# EAGLE design ProbeBoard (EAGLE 9.2.1)

## Sheet 1 of 3: ADC Schematic
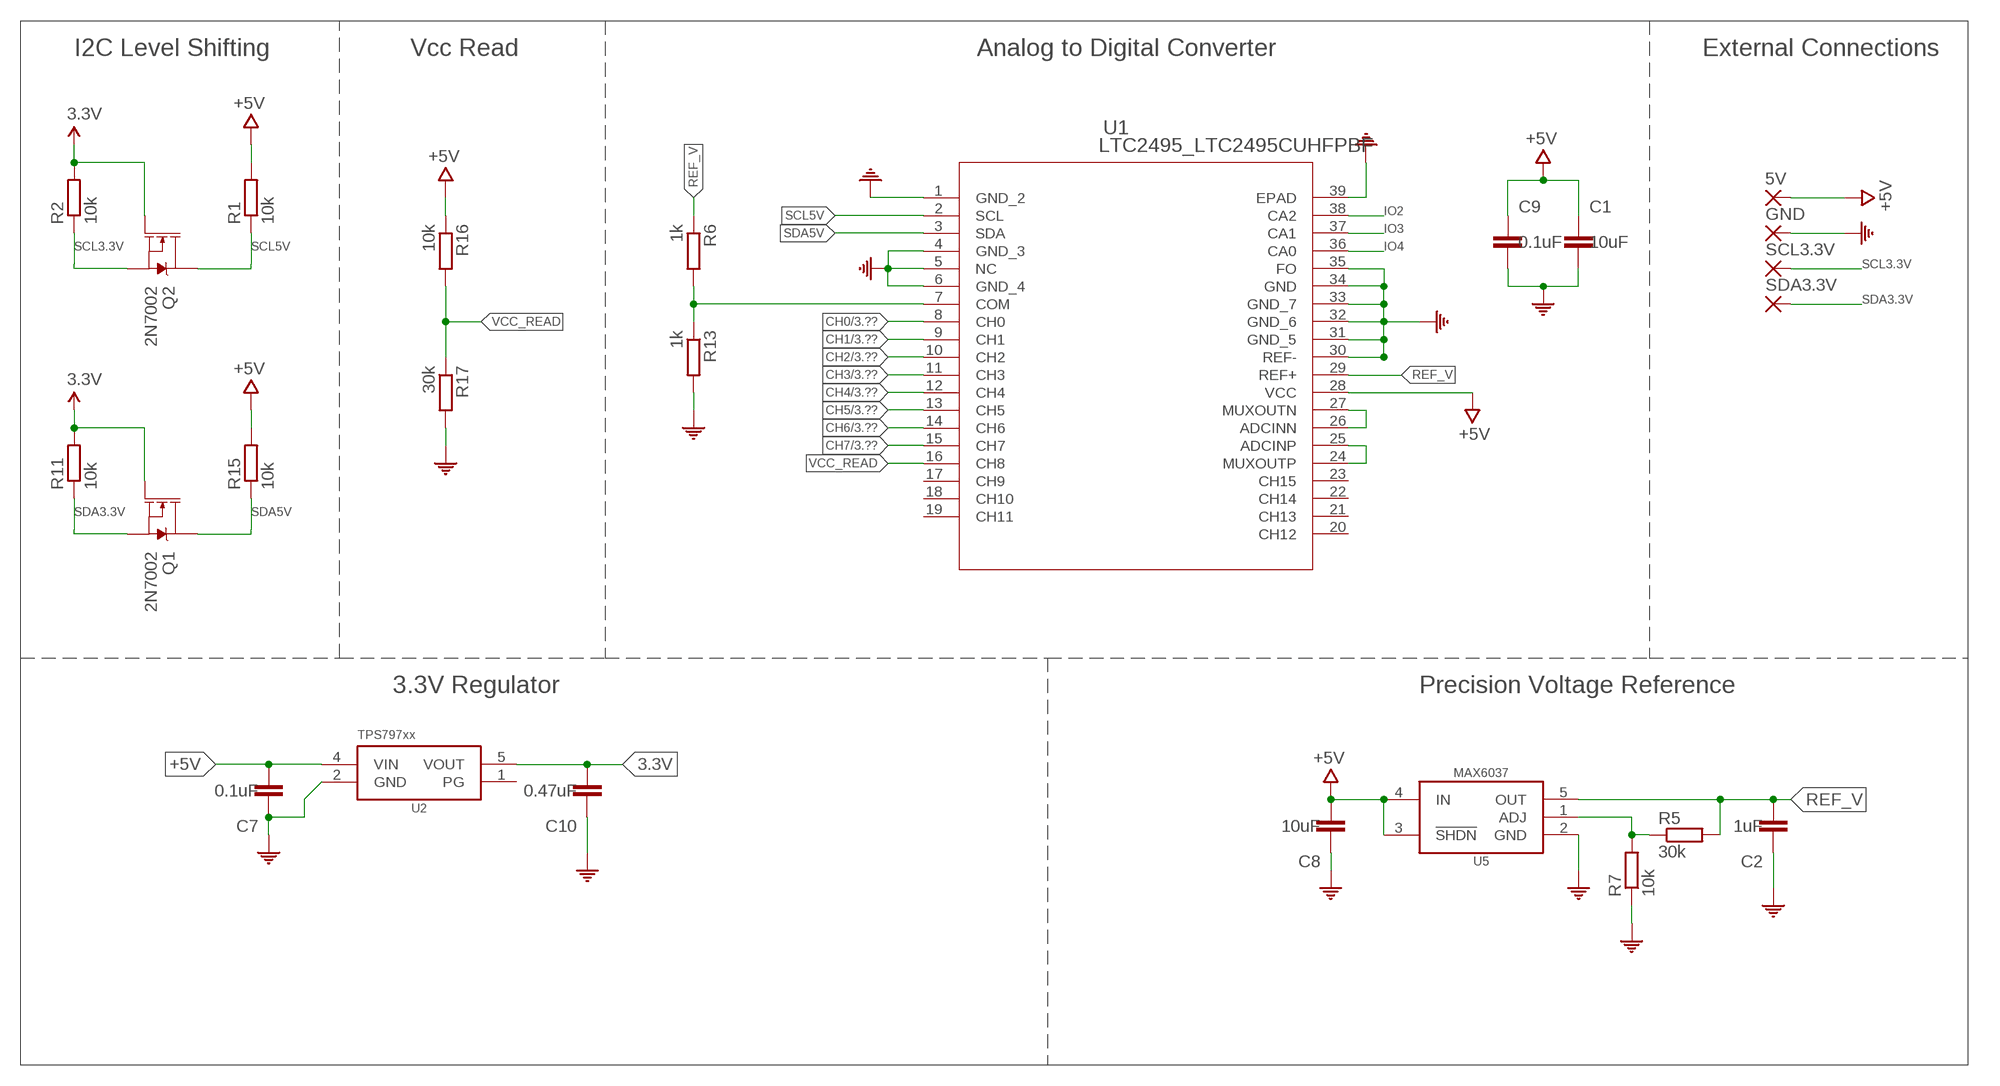
[diagram p0: schematic, sheet 1]

### Parts
5V  1,6/0,9  [1,6/0,9]
C1  10uF  C-EU10UFC0603  [C0603]
C2  1uF  C-EU1UFC0603  [C0603]
C7  0.1uF  C-EU0.1UFC0603  [C0603]
C8  10uF  C-EU10UFC0603  [C0603]
C9  0.1uF  C-EU0.1UFC0603  [C0603]
C10  0.47uF  C-EU0.47UFC0603  [C0603]
GND  1,6/0,9  [1,6/0,9]
Q1  2N7002  MOSFET-NCH-2N7002PW  [SOT323]
Q2  2N7002  MOSFET-NCH-2N7002PW  [SOT323]
R1  10k  R-EU_10KR0603  [R0603]
R2  10k  R-EU_10KR0603  [R0603]
R5  30k  R-EU_P30KR0603  [R0603]
R6  1k  R-EU_P1KR0603  [R0603]
R7  10k  R-EU_P10KR0603  [R0603]
R11  10k  R-EU_10KR0603  [R0603]
R13  1k  R-EU_P1KR0603  [R0603]
R15  10k  R-EU_10KR0603  [R0603]
R16  10k  R-EU_P10KR0603  [R0603]
R17  30k  R-EU_P30KR0603  [R0603]
SCL3.3V  1,6/0,9  [1,6/0,9]
SDA3.3V  1,6/0,9  [1,6/0,9]
U1  LTC2495_LTC2495CUHFPBF  [LTC2495_QFN-38_UHF]
U2  TPS79733  [DCK_R-PDSO-G5]
U5  MAX6037ADJSOT23  [SOT23-5]

### Nets
3.3V: C10.2 Q1.1(G) Q2.1(G) R2.2 R11.2 U2.5(VOUT)
+5V: 5V.1(P) C1.1 C7.2 C8.2 C9.1 R1.2 R15.2 R16.1 U1.28(VCC) U2.4(VIN) U5.3(!SHDN) U5.4(IN) ; also sheet 2,3
CH0: U1.8(CH0) ; also sheet 3
CH1: U1.9(CH1) ; also sheet 3
CH2: U1.10(CH2) ; also sheet 3
CH3: U1.11(CH3) ; also sheet 3
CH4: U1.12(CH4) ; also sheet 3
CH5: U1.13(CH5) ; also sheet 3
CH6: U1.14(CH6) ; also sheet 3
CH7: U1.15(CH7) ; also sheet 3
COM: C1.2 C2.1 C7.1 C8.1 C9.2 C10.1 GND.1(P) R7.1 R13.2 R17.2 U1.1(GND_2) U1.4(GND_3) U1.5(NC) U1.6(GND_4) U1.30(REF-) U1.31(GND_5) U1.32(GND_6) U1.33(GND_7) U1.34(GND) U1.35(FO) U1.39(EPAD) U2.2(GND) U5.2(GND) ; also sheet 2,3
IO2: U1.38(CA2) ; also sheet 2
IO3: U1.37(CA1) ; also sheet 2
IO4: U1.36(CA0) ; also sheet 2
N$2: U1.26(ADCINN) U1.27(MUXOUTN)
N$3: U1.24(MUXOUTP) U1.25(ADCINP)
N$4: R5.1 R7.2 U5.1(ADJ)
N$5: R6.2 R13.1 U1.7(COM)
REF_V: C2.2 R5.2 R6.1 U1.29(REF+) U5.5(OUT)
SCL3.3V: Q2.2(S) R2.1 SCL3.3V.1(P)
SCL5V: Q2.3(D) R1.1 U1.2(SCL) ; also sheet 2
SDA3.3V: Q1.2(S) R11.1 SDA3.3V.1(P)
SDA5V: Q1.3(D) R15.1 U1.3(SDA) ; also sheet 2
VCC_READ: R16.2 R17.1 U1.16(CH8)
Unconnected: U1.17(CH9) U1.18(CH10) U1.19(CH11) U1.20(CH12) U1.21(CH13) U1.22(CH14) U1.23(CH15) U2.1(PG)

### Notes on the sheet
- I2C Level Shifting | Vcc Read | Analog to Digital Converter | External Connections
- 3.3V Regulator | Precision Voltage Reference

## Sheet 2 of 3: Arduino Schematic
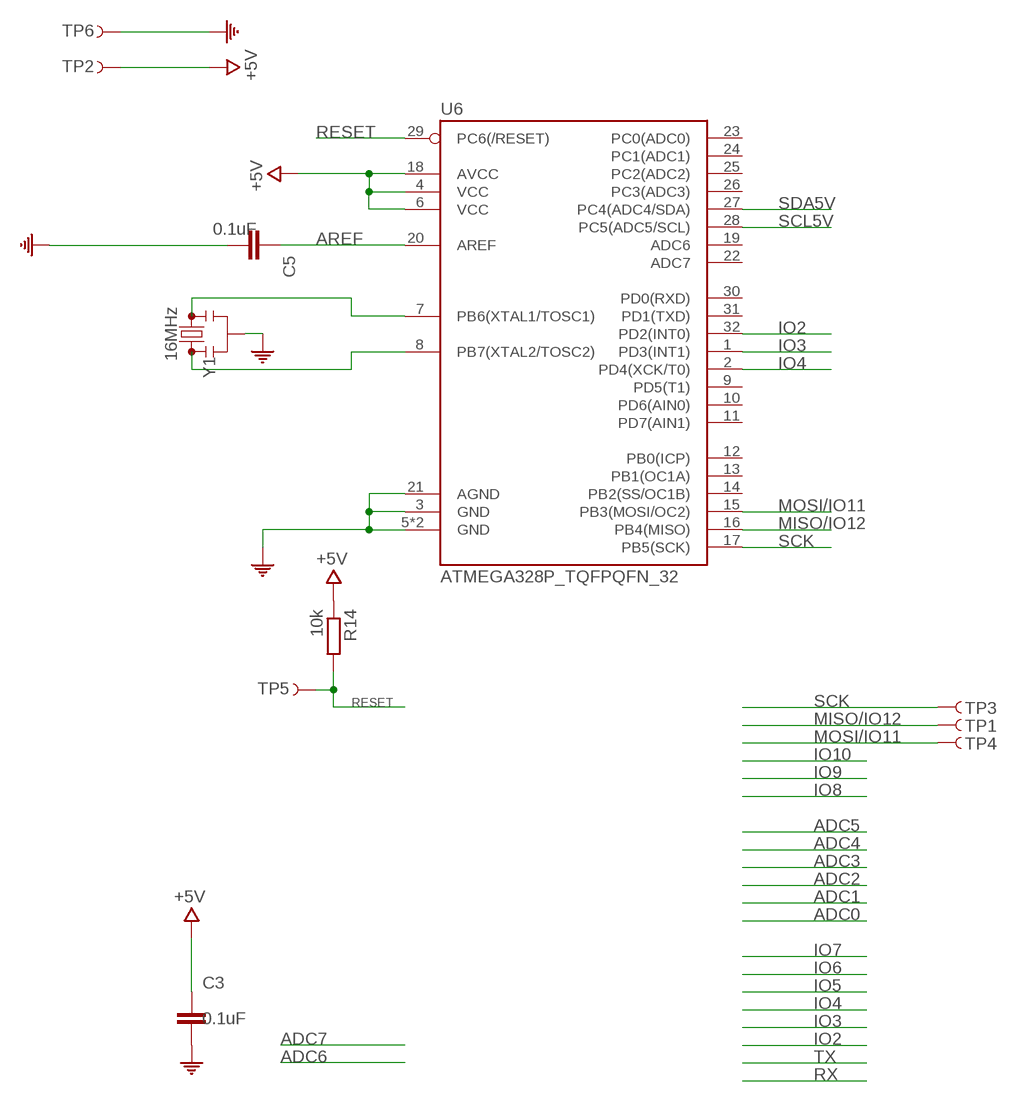
[diagram p1: schematic, sheet 2]

### Parts
C3  0.1uF  C-EU0.1UFC0603  [C0603]
C5  0.1uF  C-EU0.1UFC0603  [C0603]
R14  10k  R-EU_10KR0603  [R0603]
TP1  TEST-POINT3  [PAD.03X.03]
TP2  TEST-POINT3  [PAD.03X.03]
TP3  TEST-POINT3  [PAD.03X.03]
TP4  TEST-POINT3  [PAD.03X.03]
TP5  TEST-POINT3  [PAD.03X.03]
TP6  TEST-POINT3  [PAD.03X.03]
U6  ATMEGA328P_TQFPQFN_32  [QFN32]
Y1  16MHz  RESONATOR16MHZSMD_3.2X1.3  [RESONATOR-SMD-3.2X1.3]

### Nets
+5V: C3.1 R14.1 TP2.P$1 U6.4(VCC) U6.6(VCC) U6.18(AVCC) ; also sheet 1,3
AREF: C5.1 U6.20(AREF)
COM: C3.2 C5.2 TP6.P$1 U6.3(GND) U6.5(GND) U6.21(AGND) U6.EP(GND) Y1.2 ; also sheet 1,3
IO2: U6.32(PD2(INT0)) ; also sheet 1
IO3: U6.1(PD3(INT1)) ; also sheet 1
IO4: U6.2(PD4(XCK/T0)) ; also sheet 1
MISO/IO12: TP1.P$1 U6.16(PB4(MISO))
MOSI/IO11: TP4.P$1 U6.15(PB3(MOSI/OC2))
N$1: U6.7(PB6(XTAL1/TOSC1)) Y1.3
N$7: U6.8(PB7(XTAL2/TOSC2)) Y1.1
RESET: R14.2 TP5.P$1 U6.29(PC6(/RESET))
SCK: TP3.P$1 U6.17(PB5(SCK))
SCL5V: U6.28(PC5(ADC5/SCL)) ; also sheet 1
SDA5V: U6.27(PC4(ADC4/SDA)) ; also sheet 1
Unconnected: U6.9(PD5(T1)) U6.10(PD6(AIN0)) U6.11(PD7(AIN1)) U6.12(PB0(ICP)) U6.13(PB1(OC1A)) U6.14(PB2(SS/OC1B)) U6.19(ADC6) U6.22(ADC7) U6.23(PC0(ADC0)) U6.24(PC1(ADC1)) U6.25(PC2(ADC2)) U6.26(PC3(ADC3)) U6.30(PD0(RXD)) U6.31(PD1(TXD))

## Sheet 3 of 3: Thermistor Connections
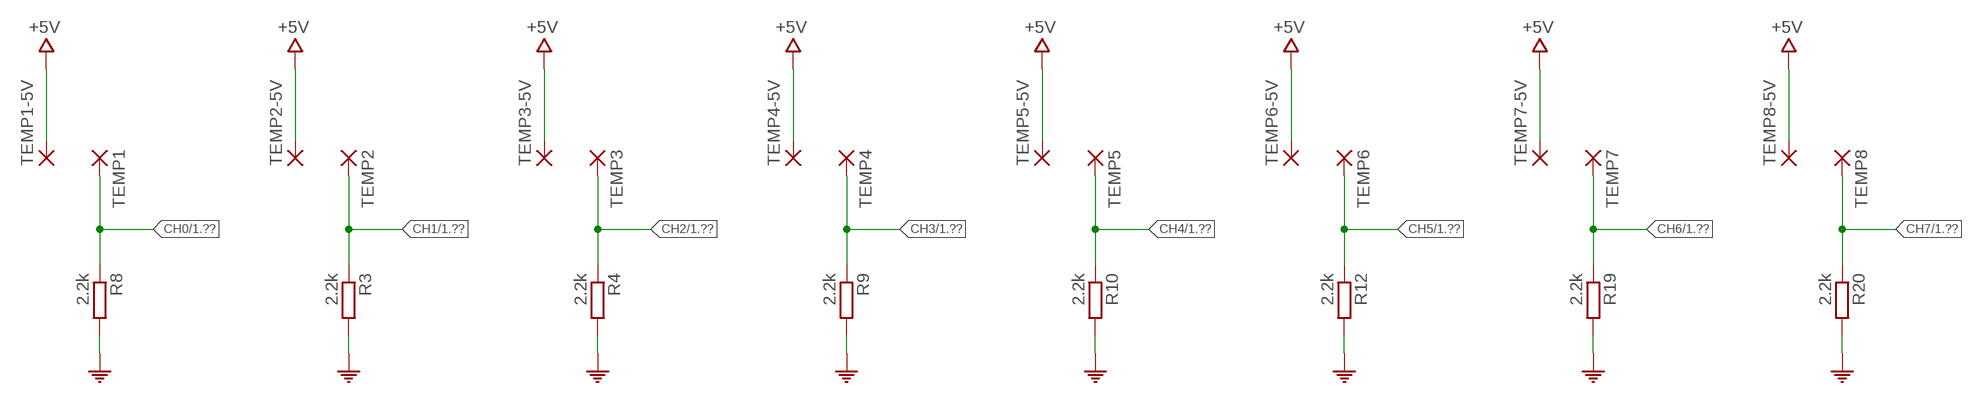
[diagram p2: schematic, sheet 3]

### Parts
R3  2.2k  R-EU_R0603  [R0603]
R4  2.2k  R-EU_R0603  [R0603]
R8  2.2k  R-EU_R0603  [R0603]
R9  2.2k  R-EU_R0603  [R0603]
R10  2.2k  R-EU_R0603  [R0603]
R12  2.2k  R-EU_R0603  [R0603]
R19  2.2k  R-EU_R0603  [R0603]
R20  2.2k  R-EU_R0603  [R0603]
TEMP1  1,6/0,9  [1,6/0,9]
TEMP1-5V  1,6/0,9  [1,6/0,9]
TEMP2  1,6/0,9  [1,6/0,9]
TEMP2-5V  1,6/0,9  [1,6/0,9]
TEMP3  1,6/0,9  [1,6/0,9]
TEMP3-5V  1,6/0,9  [1,6/0,9]
TEMP4  1,6/0,9  [1,6/0,9]
TEMP4-5V  1,6/0,9  [1,6/0,9]
TEMP5  1,6/0,9  [1,6/0,9]
TEMP5-5V  1,6/0,9  [1,6/0,9]
TEMP6  1,6/0,9  [1,6/0,9]
TEMP6-5V  1,6/0,9  [1,6/0,9]
TEMP7  1,6/0,9  [1,6/0,9]
TEMP7-5V  1,6/0,9  [1,6/0,9]
TEMP8  1,6/0,9  [1,6/0,9]
TEMP8-5V  1,6/0,9  [1,6/0,9]

### Nets
+5V: TEMP1-5V.1(P) TEMP2-5V.1(P) TEMP3-5V.1(P) TEMP4-5V.1(P) TEMP5-5V.1(P) TEMP6-5V.1(P) TEMP7-5V.1(P) TEMP8-5V.1(P) ; also sheet 1,2
CH0: R8.1 TEMP1.1(P) ; also sheet 1
CH1: R3.1 TEMP2.1(P) ; also sheet 1
CH2: R4.1 TEMP3.1(P) ; also sheet 1
CH3: R9.1 TEMP4.1(P) ; also sheet 1
CH4: R10.1 TEMP5.1(P) ; also sheet 1
CH5: R12.1 TEMP6.1(P) ; also sheet 1
CH6: R19.1 TEMP7.1(P) ; also sheet 1
CH7: R20.1 TEMP8.1(P) ; also sheet 1
COM: R3.2 R4.2 R8.2 R9.2 R10.2 R12.2 R19.2 R20.2 ; also sheet 1,2

## Library data of the parts
5V GND SCL3.3V SDA3.3V TEMP1 TEMP1-5V TEMP2 TEMP2-5V TEMP3 TEMP3-5V TEMP4 TEMP4-5V TEMP5 TEMP5-5V TEMP6 TEMP6-5V TEMP7 TEMP7-5V TEMP8 TEMP8-5V = wirepad:1,6/0,9: THROUGH-HOLE PAD
C1 C8 = bschulz_passives:C-EU: CAPACITOR, European symbol; DIGIKEY: 490-10728-1-ND; DIGIKEY_PART_NUMBER: 445-9104-6-ND; MANUFACTURER: TDK Corporation; MANUFACTURER_PART_NUMBER: C1608X7S0J106M080AC; MF: Murata; MPN: GRM188R61C106KAALD; PRICE: 0.18328
C2 = bschulz_passives:C-EU: CAPACITOR, European symbol; DIGIKEY: 490-10479-1-ND; DIGIKEY_PART_NUMBER: 1276-1184-6-ND; MANUFACTURER: Samsung Electro-Mechanics; MANUFACTURER_PART_NUMBER: CL10B105KA8NNNC; MF: Murata; MPN: GRM188R61C105KA12D; PRICE: 0.01719
C3 C5 C7 C9 = bschulz_passives:C-EU: CAPACITOR, European symbol; DIGIKEY: 490-6051-1-ND; DIGIKEY_PART_NUMBER: 478-7939-2-ND; MANUFACTURER: AVX Corporation; MANUFACTURER_PART_NUMBER: 0603ZC104KAT2A; MF: Murata; MPN: GCM188R71E104KA57D; PRICE: 0.08325
C10 = bschulz_passives:C-EU: CAPACITOR, European symbol; DIGIKEY: 1276-2083-1-ND; DIGIKEY_PART_NUMBER: 478-10367-1-ND; MANUFACTURER: AVX Corporation; MANUFACTURER_PART_NUMBER: 0603ZC474KAT2A; MF: Samsung; MPN: CL10B474KA8NNNC; PRICE: 0.02904
Q1 Q2 = bschulz:MOSFET-NCH: N-channel MOSFETs Voltage controlled devices that allow control of high current outputs. SparkFun Products: SparkFun OpenScale <https://www.sparkfun.com/products/13261> SparkFun Digital Sandbox <https://www.sparkfun.com/products/12651> SparkFun Monster Moto Shield <https://www.sparkfun.com/products/10182> SparkFun MOSFET Power Controller <https://www.sparkfun.com/products/11214>; DIGIKEY: 2N7002W-FDICT-ND; MF: Diodes Incorporated; MPN: 2N7002W-7-F; PROD_ID: TRANS-11151
R1 R2 R11 R14 R15 = bschulz_passives:R-EU_: RESISTOR, European symbol Digikey Parts: Yageo, 0402 <https://www.digikey.com/products/en/resistors/chip-resistor-surface-mount/52?k=&pkeyword=&sf=0&FV=ffec1104%2Cfffc000d%2C1c0002%2C440067%2C1f140000%2Cffe00034%2C400004&quantity=&ColumnSort=0&page=1&stock=1&pageSize=25> Yageo, 0603 <https://www.digikey.com/products/en/resistors/chip-resistor-surface-mount/52?k=&pkeyword=&s=4356&s=47360&sf=0&FV=fffc000d%2C1c0002%2C142c040c%2C1f140000%2Cffe00034&quantity=10&ColumnSort=1000011&page=1&stock=1&pageSize=25> Panasonic, 0603 <https://www.digikey.com/products/en/resistors/chip-resistor-surface-mount/52?k=&pkeyword=&pv252=68&sf=0&FV=ffec373d%2C1c0002%2C142c040c%2C1f140000%2Cffe00034%2C80002%2Cc0001&quantity=&ColumnSort=0&page=1&stock=1&pageSize=25> Panasonic, precision, 0603 <https://www.digikey.com/products/en/resistors/chip-resistor-surface-mount/52?FV=ffec4907%2Cfffc000a%2Cc0172%2C142c040c%2C1f140000%2Cffe00034%2C1c0002&quantity=100&ColumnSort=2085&page=1&stock=1&pageSize=25> Panasonic, 0805 <https://www.digikey.com/products/en/resistors/chip-resistor-surface-mount/52?k=&pkeyword=&pv3=1&sf=0&FV=ffec373d%2C1c0002%2C1f140000%2Cffe00034%2C142c040d&quantity=&ColumnSort=0&page=1&stock=1&pageSize=25> Rohm, current sense <https://www.digikey.com/products/en/resistors/chip-resistor-surface-mount/52?k=&pkeyword=&pv3=1&sf=0&FV=ffecb688%2C1f140000%2Cffe00034%2C1c0002&quantity=&ColumnSort=0&page=1&stock=1&pageSize=25> Vishay, pulse proof automotive <https://www.digikey.com/products/en/resistors/chip-resistor-surface-mount/52?k=&pkeyword=&pv7=2&sf=0&FV=ffec5d6b%2Cffe00034%2C1f140000&quantity=&ColumnSort=0&page=1&stock=1&pageSize=25>; DIGIKEY: 311-10.0KHRCT-ND; DIGIKEY_PART_NUMBER: P10KGTR-ND; MANUFACTURER: Panasonic Electronic Components; MANUFACTURER_PART_NUMBER: ERJ-3GEYJ103V; MF: Yageo; MPN: RC0603FR-0710KL; PRICE: 0.00494; VALUE_PART: 10k
R3 R4 R8-R10 R12 R19 R20 = bschulz_passives:R-EU_: RESISTOR, European symbol Digikey Parts: Yageo, 0402 <https://www.digikey.com/products/en/resistors/chip-resistor-surface-mount/52?k=&pkeyword=&sf=0&FV=ffec1104%2Cfffc000d%2C1c0002%2C440067%2C1f140000%2Cffe00034%2C400004&quantity=&ColumnSort=0&page=1&stock=1&pageSize=25> Yageo, 0603 <https://www.digikey.com/products/en/resistors/chip-resistor-surface-mount/52?k=&pkeyword=&s=4356&s=47360&sf=0&FV=fffc000d%2C1c0002%2C142c040c%2C1f140000%2Cffe00034&quantity=10&ColumnSort=1000011&page=1&stock=1&pageSize=25> Panasonic, 0603 <https://www.digikey.com/products/en/resistors/chip-resistor-surface-mount/52?k=&pkeyword=&pv252=68&sf=0&FV=ffec373d%2C1c0002%2C142c040c%2C1f140000%2Cffe00034%2C80002%2Cc0001&quantity=&ColumnSort=0&page=1&stock=1&pageSize=25> Panasonic, precision, 0603 <https://www.digikey.com/products/en/resistors/chip-resistor-surface-mount/52?FV=ffec4907%2Cfffc000a%2Cc0172%2C142c040c%2C1f140000%2Cffe00034%2C1c0002&quantity=100&ColumnSort=2085&page=1&stock=1&pageSize=25> Panasonic, 0805 <https://www.digikey.com/products/en/resistors/chip-resistor-surface-mount/52?k=&pkeyword=&pv3=1&sf=0&FV=ffec373d%2C1c0002%2C1f140000%2Cffe00034%2C142c040d&quantity=&ColumnSort=0&page=1&stock=1&pageSize=25> Rohm, current sense <https://www.digikey.com/products/en/resistors/chip-resistor-surface-mount/52?k=&pkeyword=&pv3=1&sf=0&FV=ffecb688%2C1f140000%2Cffe00034%2C1c0002&quantity=&ColumnSort=0&page=1&stock=1&pageSize=25> Vishay, pulse proof automotive <https://www.digikey.com/products/en/resistors/chip-resistor-surface-mount/52?k=&pkeyword=&pv7=2&sf=0&FV=ffec5d6b%2Cffe00034%2C1f140000&quantity=&ColumnSort=0&page=1&stock=1&pageSize=25>; DIGIKEY_PART_NUMBER: P2.2KDBTR-ND; MANUFACTURER: Panasonic Electronic Components; MANUFACTURER_PART_NUMBER: ERA-3AEB222V; MF: Yageo; PRICE: 0.03717
R5 = bschulz_passives:R-EU_: RESISTOR, European symbol Digikey Parts: Yageo, 0402 <https://www.digikey.com/products/en/resistors/chip-resistor-surface-mount/52?k=&pkeyword=&sf=0&FV=ffec1104%2Cfffc000d%2C1c0002%2C440067%2C1f140000%2Cffe00034%2C400004&quantity=&ColumnSort=0&page=1&stock=1&pageSize=25> Yageo, 0603 <https://www.digikey.com/products/en/resistors/chip-resistor-surface-mount/52?k=&pkeyword=&s=4356&s=47360&sf=0&FV=fffc000d%2C1c0002%2C142c040c%2C1f140000%2Cffe00034&quantity=10&ColumnSort=1000011&page=1&stock=1&pageSize=25> Panasonic, 0603 <https://www.digikey.com/products/en/resistors/chip-resistor-surface-mount/52?k=&pkeyword=&pv252=68&sf=0&FV=ffec373d%2C1c0002%2C142c040c%2C1f140000%2Cffe00034%2C80002%2Cc0001&quantity=&ColumnSort=0&page=1&stock=1&pageSize=25> Panasonic, precision, 0603 <https://www.digikey.com/products/en/resistors/chip-resistor-surface-mount/52?FV=ffec4907%2Cfffc000a%2Cc0172%2C142c040c%2C1f140000%2Cffe00034%2C1c0002&quantity=100&ColumnSort=2085&page=1&stock=1&pageSize=25> Panasonic, 0805 <https://www.digikey.com/products/en/resistors/chip-resistor-surface-mount/52?k=&pkeyword=&pv3=1&sf=0&FV=ffec373d%2C1c0002%2C1f140000%2Cffe00034%2C142c040d&quantity=&ColumnSort=0&page=1&stock=1&pageSize=25> Rohm, current sense <https://www.digikey.com/products/en/resistors/chip-resistor-surface-mount/52?k=&pkeyword=&pv3=1&sf=0&FV=ffecb688%2C1f140000%2Cffe00034%2C1c0002&quantity=&ColumnSort=0&page=1&stock=1&pageSize=25> Vishay, pulse proof automotive <https://www.digikey.com/products/en/resistors/chip-resistor-surface-mount/52?k=&pkeyword=&pv7=2&sf=0&FV=ffec5d6b%2Cffe00034%2C1f140000&quantity=&ColumnSort=0&page=1&stock=1&pageSize=25>; DIGIKEY: P30KDBCT-ND; DIGIKEY_PART_NUMBER: P30KGDKR-ND; MANUFACTURER: Panasonic Electronic Components; MANUFACTURER_PART_NUMBER: ERJ-3GEYJ303V; MF: Panasonic; MPN: ERA-3AEB303V; PRICE: 0.00758; VALUE_PART: 30k
R6 R13 = bschulz_passives:R-EU_: RESISTOR, European symbol Digikey Parts: Yageo, 0402 <https://www.digikey.com/products/en/resistors/chip-resistor-surface-mount/52?k=&pkeyword=&sf=0&FV=ffec1104%2Cfffc000d%2C1c0002%2C440067%2C1f140000%2Cffe00034%2C400004&quantity=&ColumnSort=0&page=1&stock=1&pageSize=25> Yageo, 0603 <https://www.digikey.com/products/en/resistors/chip-resistor-surface-mount/52?k=&pkeyword=&s=4356&s=47360&sf=0&FV=fffc000d%2C1c0002%2C142c040c%2C1f140000%2Cffe00034&quantity=10&ColumnSort=1000011&page=1&stock=1&pageSize=25> Panasonic, 0603 <https://www.digikey.com/products/en/resistors/chip-resistor-surface-mount/52?k=&pkeyword=&pv252=68&sf=0&FV=ffec373d%2C1c0002%2C142c040c%2C1f140000%2Cffe00034%2C80002%2Cc0001&quantity=&ColumnSort=0&page=1&stock=1&pageSize=25> Panasonic, precision, 0603 <https://www.digikey.com/products/en/resistors/chip-resistor-surface-mount/52?FV=ffec4907%2Cfffc000a%2Cc0172%2C142c040c%2C1f140000%2Cffe00034%2C1c0002&quantity=100&ColumnSort=2085&page=1&stock=1&pageSize=25> Panasonic, 0805 <https://www.digikey.com/products/en/resistors/chip-resistor-surface-mount/52?k=&pkeyword=&pv3=1&sf=0&FV=ffec373d%2C1c0002%2C1f140000%2Cffe00034%2C142c040d&quantity=&ColumnSort=0&page=1&stock=1&pageSize=25> Rohm, current sense <https://www.digikey.com/products/en/resistors/chip-resistor-surface-mount/52?k=&pkeyword=&pv3=1&sf=0&FV=ffecb688%2C1f140000%2Cffe00034%2C1c0002&quantity=&ColumnSort=0&page=1&stock=1&pageSize=25> Vishay, pulse proof automotive <https://www.digikey.com/products/en/resistors/chip-resistor-surface-mount/52?k=&pkeyword=&pv7=2&sf=0&FV=ffec5d6b%2Cffe00034%2C1f140000&quantity=&ColumnSort=0&page=1&stock=1&pageSize=25>; DIGIKEY: P1.0KDBCT-ND; DIGIKEY_PART_NUMBER: P1.0KDBDKR-ND; MANUFACTURER: Panasonic Electronic Components; MANUFACTURER_PART_NUMBER: ERA-3AEB102V; MF: Panasonic; MPN: ERA-3AEB102V; PRICE: 0.04906; VALUE_PART: 1k
R7 = bschulz_passives:R-EU_: RESISTOR, European symbol Digikey Parts: Yageo, 0402 <https://www.digikey.com/products/en/resistors/chip-resistor-surface-mount/52?k=&pkeyword=&sf=0&FV=ffec1104%2Cfffc000d%2C1c0002%2C440067%2C1f140000%2Cffe00034%2C400004&quantity=&ColumnSort=0&page=1&stock=1&pageSize=25> Yageo, 0603 <https://www.digikey.com/products/en/resistors/chip-resistor-surface-mount/52?k=&pkeyword=&s=4356&s=47360&sf=0&FV=fffc000d%2C1c0002%2C142c040c%2C1f140000%2Cffe00034&quantity=10&ColumnSort=1000011&page=1&stock=1&pageSize=25> Panasonic, 0603 <https://www.digikey.com/products/en/resistors/chip-resistor-surface-mount/52?k=&pkeyword=&pv252=68&sf=0&FV=ffec373d%2C1c0002%2C142c040c%2C1f140000%2Cffe00034%2C80002%2Cc0001&quantity=&ColumnSort=0&page=1&stock=1&pageSize=25> Panasonic, precision, 0603 <https://www.digikey.com/products/en/resistors/chip-resistor-surface-mount/52?FV=ffec4907%2Cfffc000a%2Cc0172%2C142c040c%2C1f140000%2Cffe00034%2C1c0002&quantity=100&ColumnSort=2085&page=1&stock=1&pageSize=25> Panasonic, 0805 <https://www.digikey.com/products/en/resistors/chip-resistor-surface-mount/52?k=&pkeyword=&pv3=1&sf=0&FV=ffec373d%2C1c0002%2C1f140000%2Cffe00034%2C142c040d&quantity=&ColumnSort=0&page=1&stock=1&pageSize=25> Rohm, current sense <https://www.digikey.com/products/en/resistors/chip-resistor-surface-mount/52?k=&pkeyword=&pv3=1&sf=0&FV=ffecb688%2C1f140000%2Cffe00034%2C1c0002&quantity=&ColumnSort=0&page=1&stock=1&pageSize=25> Vishay, pulse proof automotive <https://www.digikey.com/products/en/resistors/chip-resistor-surface-mount/52?k=&pkeyword=&pv7=2&sf=0&FV=ffec5d6b%2Cffe00034%2C1f140000&quantity=&ColumnSort=0&page=1&stock=1&pageSize=25>; DIGIKEY: P10KDBCT-ND; DIGIKEY_PART_NUMBER: P10KGTR-ND; MANUFACTURER: Panasonic Electronic Components; MANUFACTURER_PART_NUMBER: ERJ-3GEYJ103V; MF: Panasonic; MPN: ERA-3AEB103V; PRICE: 0.00494; VALUE_PART: 10k
R16 = bschulz_passives:R-EU_: RESISTOR, European symbol Digikey Parts: Yageo, 0402 <https://www.digikey.com/products/en/resistors/chip-resistor-surface-mount/52?k=&pkeyword=&sf=0&FV=ffec1104%2Cfffc000d%2C1c0002%2C440067%2C1f140000%2Cffe00034%2C400004&quantity=&ColumnSort=0&page=1&stock=1&pageSize=25> Yageo, 0603 <https://www.digikey.com/products/en/resistors/chip-resistor-surface-mount/52?k=&pkeyword=&s=4356&s=47360&sf=0&FV=fffc000d%2C1c0002%2C142c040c%2C1f140000%2Cffe00034&quantity=10&ColumnSort=1000011&page=1&stock=1&pageSize=25> Panasonic, 0603 <https://www.digikey.com/products/en/resistors/chip-resistor-surface-mount/52?k=&pkeyword=&pv252=68&sf=0&FV=ffec373d%2C1c0002%2C142c040c%2C1f140000%2Cffe00034%2C80002%2Cc0001&quantity=&ColumnSort=0&page=1&stock=1&pageSize=25> Panasonic, precision, 0603 <https://www.digikey.com/products/en/resistors/chip-resistor-surface-mount/52?FV=ffec4907%2Cfffc000a%2Cc0172%2C142c040c%2C1f140000%2Cffe00034%2C1c0002&quantity=100&ColumnSort=2085&page=1&stock=1&pageSize=25> Panasonic, 0805 <https://www.digikey.com/products/en/resistors/chip-resistor-surface-mount/52?k=&pkeyword=&pv3=1&sf=0&FV=ffec373d%2C1c0002%2C1f140000%2Cffe00034%2C142c040d&quantity=&ColumnSort=0&page=1&stock=1&pageSize=25> Rohm, current sense <https://www.digikey.com/products/en/resistors/chip-resistor-surface-mount/52?k=&pkeyword=&pv3=1&sf=0&FV=ffecb688%2C1f140000%2Cffe00034%2C1c0002&quantity=&ColumnSort=0&page=1&stock=1&pageSize=25> Vishay, pulse proof automotive <https://www.digikey.com/products/en/resistors/chip-resistor-surface-mount/52?k=&pkeyword=&pv7=2&sf=0&FV=ffec5d6b%2Cffe00034%2C1f140000&quantity=&ColumnSort=0&page=1&stock=1&pageSize=25>; DIGIKEY: P10KDBCT-ND; DIGIKEY_PART_NUMBER: P1.0KDBDKR-ND; MANUFACTURER: Panasonic Electronic Components; MANUFACTURER_PART_NUMBER: ERA-3AEB102V; MF: Panasonic; MPN: ERA-3AEB103V; PRICE: 0.04906; VALUE_PART: 10k
R17 = bschulz_passives:R-EU_: RESISTOR, European symbol Digikey Parts: Yageo, 0402 <https://www.digikey.com/products/en/resistors/chip-resistor-surface-mount/52?k=&pkeyword=&sf=0&FV=ffec1104%2Cfffc000d%2C1c0002%2C440067%2C1f140000%2Cffe00034%2C400004&quantity=&ColumnSort=0&page=1&stock=1&pageSize=25> Yageo, 0603 <https://www.digikey.com/products/en/resistors/chip-resistor-surface-mount/52?k=&pkeyword=&s=4356&s=47360&sf=0&FV=fffc000d%2C1c0002%2C142c040c%2C1f140000%2Cffe00034&quantity=10&ColumnSort=1000011&page=1&stock=1&pageSize=25> Panasonic, 0603 <https://www.digikey.com/products/en/resistors/chip-resistor-surface-mount/52?k=&pkeyword=&pv252=68&sf=0&FV=ffec373d%2C1c0002%2C142c040c%2C1f140000%2Cffe00034%2C80002%2Cc0001&quantity=&ColumnSort=0&page=1&stock=1&pageSize=25> Panasonic, precision, 0603 <https://www.digikey.com/products/en/resistors/chip-resistor-surface-mount/52?FV=ffec4907%2Cfffc000a%2Cc0172%2C142c040c%2C1f140000%2Cffe00034%2C1c0002&quantity=100&ColumnSort=2085&page=1&stock=1&pageSize=25> Panasonic, 0805 <https://www.digikey.com/products/en/resistors/chip-resistor-surface-mount/52?k=&pkeyword=&pv3=1&sf=0&FV=ffec373d%2C1c0002%2C1f140000%2Cffe00034%2C142c040d&quantity=&ColumnSort=0&page=1&stock=1&pageSize=25> Rohm, current sense <https://www.digikey.com/products/en/resistors/chip-resistor-surface-mount/52?k=&pkeyword=&pv3=1&sf=0&FV=ffecb688%2C1f140000%2Cffe00034%2C1c0002&quantity=&ColumnSort=0&page=1&stock=1&pageSize=25> Vishay, pulse proof automotive <https://www.digikey.com/products/en/resistors/chip-resistor-surface-mount/52?k=&pkeyword=&pv7=2&sf=0&FV=ffec5d6b%2Cffe00034%2C1f140000&quantity=&ColumnSort=0&page=1&stock=1&pageSize=25>; DIGIKEY: P30KDBCT-ND; DIGIKEY_PART_NUMBER: P2.2KDBTR-ND; MANUFACTURER: Panasonic Electronic Components; MANUFACTURER_PART_NUMBER: ERA-3AEB222V; MF: Panasonic; MPN: ERA-3AEB303V; PRICE: 0.03717; VALUE_PART: 30k
TP1-TP6 = SparkFun-Passives:TEST-POINT: Bare copper test points for troubleshooting or ICT
U1 = ProbeBoard:LTC2495_LTC2495CUHFPBF; DIGIKEY_PART_NUMBER: LTC2495IUHF#PBF-ND; MANUFACTURER: Linear Technology/Analog Devices; MANUFACTURER_PART_NUMBER: LTC2495CUHF#PBF; PRICE: 5.11040; VENDOR: Linear Technology
U2 = bschulz:TPS797*: TPS797* - Ultra Low Power Low Dropout Linear Regulator Characteristics: Vin: 1.4V ~ 5.5V Vout: 1.8, 2.85, 3.0, 3.3V fixed IQ: 1.2μA typ, 2μA max Voltage Accuracy: 4% max Dropout Voltage: 105mV @ 10mA Output Current: 50 mA Operating Temperature: -40°C to 85°C Digikey: TPS79733 (3.3V Fixed) <https://www.digikey.com/product-detail/en/texas-instruments/TPS79733DCKR/296-11990-1-ND/390520> TPS79730 (3.0V Fixed) <https://www.digikey.com/product-detail/en/texas-instruments/TPS79730DCKR/296-11989-1-ND/390518> TPS797285 (2.85V Fixed) <https://www.digikey.com/product-detail/en/texas-instruments/TPS797285DCKR/296-25465-1-ND/2187585> TPS79718 (1.8V Fixed) <https://www.digikey.com/product-detail/en/texas-instruments/TPS79718DCKR/296-11988-1-ND/390516>; DIGIKEY: 296-11990-1-ND; MF: TI; MPN: TPS79733DCKR
U5 = bschulz:MAX6037: MAX6037 - Low Power Voltage Referance with Shutdown Characteristics: Vin: 2.5V ~ 5.5V Vout: 1.184V ~ 5V IQ: 190μA Iout: 5mA Tolerance: ± 0.3% Operating Temperature: -40°C to 125°C Digikey: MAX6037BAUKADJ (Adjustable) <https://www.digikey.com/product-detail/en/maxim-integrated/MAX6037BAUKADJ-T/MAX6037BAUKADJ-TCT-ND/5821111>; DIGIKEY: MAX6037BAUKADJ+TCT-ND; MF: Maxim; MPN: MAX6037BAUKADJ+T
U6 = bschulz:ATMEGA328P_TQFP: Popular 328P in QFP Storefront component: ATmega328 - TQFP <https://www.sparkfun.com/products/13448> (COM-13448) Datasheet <http://www.sparkfun.com/datasheets/Components/SMD/ATMega328.pdf> SparkFun Products SparkFun RedBoard - Programmed with Arduino <https://www.sparkfun.com/products/12757> (DEV-12757) Arduino Pro Mini 328 - 5V/16MHz <https://www.sparkfun.com/products/11113> (DEV-11113) Arduino Pro Mini 328 - 3.3V/8MHz <https://www.sparkfun.com/products/11114> (DEV-11114) SparkFun OpenLog <https://www.sparkfun.com/products/13712> (DEV-13712) SparkFun MicroView - OLED Arduino Module <https://www.sparkfun.com/products/12923> (DEV-12923) SparkFun Digital Sandbox <https://www.sparkfun.com/products/12651> (DEV-12651) SparkFun PicoBoard <https://www.sparkfun.com/products/11888> (WIG-11888) Arduino Fio <https://www.sparkfun.com/products/10116> (DEV-10116) LilyPad Arduino 328 Main Board <https://www.sparkfun.com/products/13342> (DEV-13342) SparkFun RedStick <https://www.sparkfun.com/products/13741> (DEV-13741) LilyPad MP3 <https://www.sparkfun.com/products/11013> (DEV-11013) LilyPad Arduino SimpleSnap <https://www.sparkfun.com/products/10941> (DEV-10941) SparkFun Stepoko <https://www.sparkfun.com/products/13899> (ROB-13899) SparkFun Geiger Counter <https://www.sparkfun.com/products/11345> (SEN-11345) SparkFun EL Sequencer <https://www.sparkfun.com/products/12781> (COM-12781) Arduino Pro 328 - 5V/16MHz <https://www.sparkfun.com/products/10915> (DEV-10915) CryptoCape <https://www.sparkfun.com/products/12773> (DEV-12773) SparkFun IR Thermometer Evaluation Board - MLX90614 <https://www.sparkfun.com/products/10740> (SEN-10740) SparkFun RedBot Mainboard <https://www.sparkfun.com/products/12097> (ROB-12097) Arduino Pro 328 - 3.3V/8MHz <https://www.sparkfun.com/products/10914> (DEV-10914) SparkFun Block for Intel® Edison - Arduino <https://www.sparkfun.com/products/13036> (DEV-13036) SparkFun Simon Says - Surface Mount Soldering Kit <https://www.sparkfun.com/products/10935> (KIT-10935) SparkFun 7-Segment Serial Display - Red <https://www.sparkfun.com/products/11441> (COM-11441) SparkFun 7-Segment Serial Display - White <https://www.sparkfun.com/products/11629> (COM-11629) SparkFun 7-Segment Serial Display - Yellow <https://www.sparkfun.com/products/11443> (COM-11443) SparkFun 7-Segment Serial Display - Kelly Green <https://www.sparkfun.com/products/11440> (COM-11440) SparkFun 7-Segment Serial Display - Blue <https://www.sparkfun.com/products/11442> (COM-11442) SparkFun OpenSegment Serial Display - 20mm (Blue) <https://www.sparkfun.com/products/11647> (COM-11647) SparkFun OpenSegment Serial Display - 20mm (Green) <https://www.sparkfun.com/products/11646> (COM-11646) SparkFun OpenSegment Serial Display - 20mm (White) <https://www.sparkfun.com/products/11648> (COM-11648) SparkFun OpenSegment Serial Display - 20mm (Red) <https://www.sparkfun.com/products/11644> (COM-11644) SparkFun OpenSegment Serial Display - 20mm (Yellow) <https://www.sparkfun.com/products/11645> (COM-11645) SparkFun OpenSegment Shield <https://www.sparkfun.com/products/13190> (DEV-13190); DIGIKEY: ATMEGA328P-MURCT-ND; MF: Atmel; MPN: ATMEGA328P-MUR
Y1 = bschulz:RESONATOR: 16MHz Resonator Digikey Example <http://www.digikey.com/product-detail/en/murata-electronics-north-america/CSTCE16M0V53-R0/490-1198-1-ND/584635> Frequency: 16MHz Frequency Stability: ±0.3% Frequency Tolerance: ±0.5% Capacitance: 15pF SparkFun Products SparkFun OpenLog <https://www.sparkfun.com/products/13712> SparkFun MicroView - OLED Arduino Module <https://www.sparkfun.com/products/12923>; DIGIKEY: 490-17948-1-ND; MF: Murata; MPN: CSTNE16M0V530000R0

## Net classes
0 default: width 0.203 mm

## Board
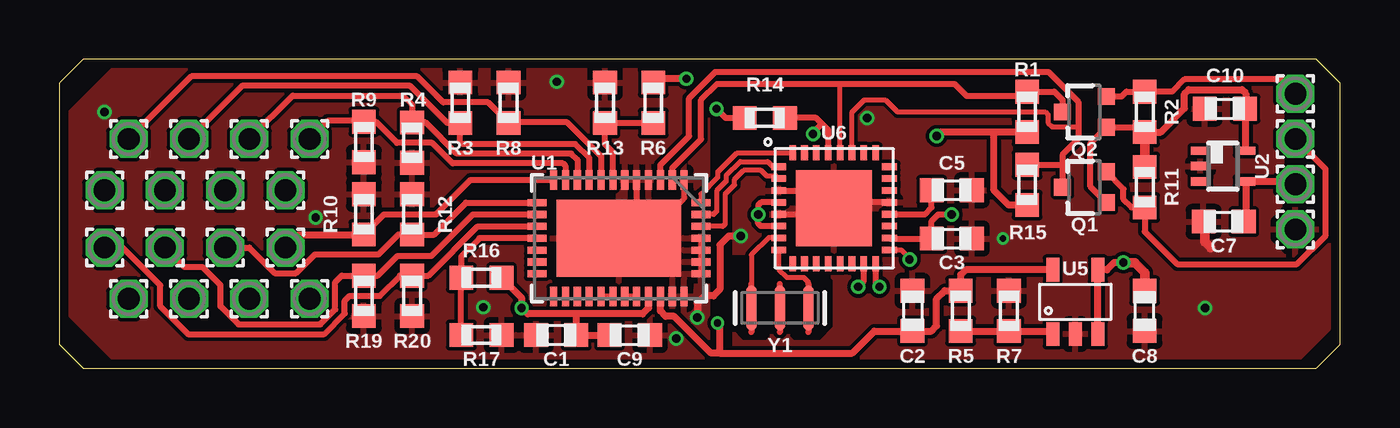
[diagram p3: board, top side]
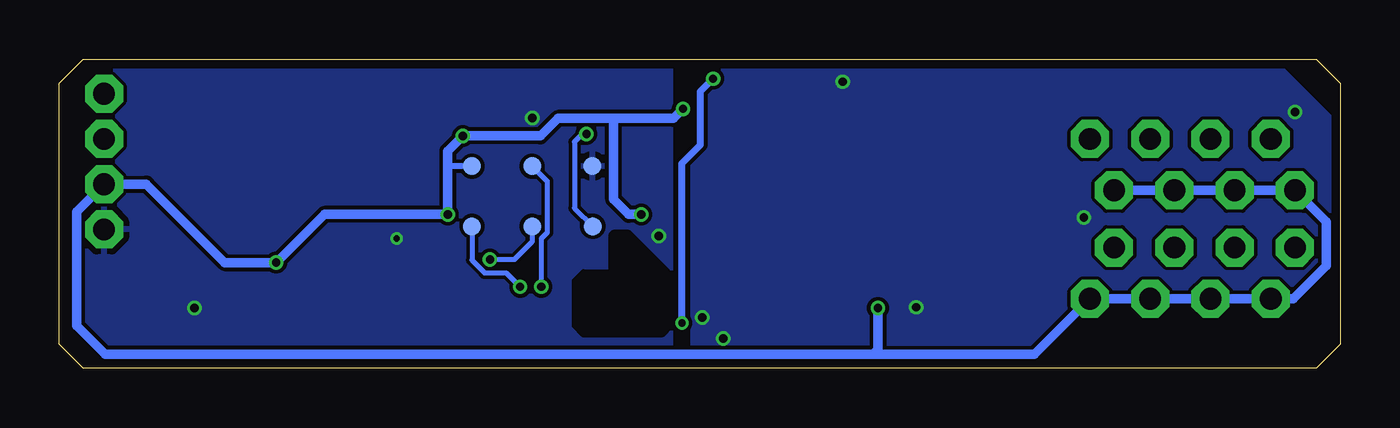
[diagram p4: board, bottom side, seen from below]

Size 53.95 x 13.01 mm. Coordinates in mm from the lower left corner, seen from the top.
Outline: 0,12.01 0,1 1,0 52.95,0 53.95,1 53.95,12.01 52.95,13.01 1,13.01 0,12.01
Copper layers (1*16): Top 0.035559375mm / dielectric 1.6mm / Bottom 0.035559375mm
Design rules "oshpark-2layer": minimum track width 6mil, minimum drill 10mil, track to track 6mil, track to pad 6mil, pad to pad 6mil, via to via 6mil, smd to smd 6mil, copper to edge 15mil, drill to drill 6mil, minimum pad ring 5mil, minimum via ring 5mil, stop-mask expansion 2.5mil, vias tented up to drill 0mil, thermal gap 10mil
tRestrict: area 28.4,1.3 to 30,4.7; area 30.9,1.3 to 32.5,3.8
bRestrict: area 28.2,1.4 to 32.3,4.1; area 28.3,3.2 to 31.4,5.7

### Footprints (pad centres in the part's own frame; a part is rotated, then mirrored left to right if it is on the bottom)
1,6/0,9 = drill 0.914 pad 1.6 octagon: 1 0,0
C0603 = smd 1 x 1: 1 -0.85,0; 2 0.85,0
SOT323 = smd 0.7 x 0.7: 1 -0.65,-0.925; 2 0.65,-0.925; 3 0,0.925
R0603 = smd 1 x 1: 1 -0.85,0; 2 0.85,0
PAD.03X.03 = smd 0.762 x 0.762: P$1 0,0
LTC2495_QFN-38_UHF = smd 0.805 x 0.3: 1 -2.452,2.75; 2 -2.452,2.25; 3 -2.452,1.75; 4 -2.452,1.25; 5 -2.452,0.75; 6 -2.452,0.25; 7 -2.452,-0.25; 8 -2.452,-0.75; 9 -2.452,-1.25; 10 -2.452,-1.75; 11 -2.452,-2.25; 12 -2.452,-2.75; 20 2.452,-2.75; 21 2.452,-2.25; 22 2.452,-1.75; 23 2.452,-1.25; 24 2.452,-0.75; 25 2.452,-0.25; 26 2.452,0.25; 27 2.452,0.75; 28 2.452,1.25; 29 2.452,1.75; 30 2.452,2.25; 31 2.452,2.75 | smd 0.3 x 0.805: 13 -1.5,-3.452; 14 -1,-3.452; 15 -0.5,-3.452; 16 0,-3.452; 17 0.5,-3.452; 18 1,-3.452; 19 1.5,-3.452; 32 1.5,3.452; 33 1,3.452; 34 0.5,3.452; 35 0,3.452; 36 -0.5,3.452; 37 -1,3.452; 38 -1.5,3.452 | smd 3.25 x 5.25: 39 0,0
DCK_R-PDSO-G5 = smd 0.35 x 0.8: 1 -0.65,-0.95; 2 0,-0.95; 3 0.65,-0.95; 4 0.65,0.95; 5 -0.65,0.95
SOT23-5 = smd 0.55 x 1: 1 -0.95,-1.35; 2 0,-1.35; 3 0.95,-1.35; 4 0.95,1.35; 5 -0.95,1.35
QFN32 = smd 0.63 x 0.28: 1 -2.335,1.75; 2 -2.335,1.25; 3 -2.335,0.75; 4 -2.335,0.25; 5 -2.335,-0.25; 6 -2.335,-0.75; 7 -2.335,-1.25; 8 -2.335,-1.75; 17 2.335,-1.75; 18 2.335,-1.25; 19 2.335,-0.75; 20 2.335,-0.25; 21 2.335,0.25; 22 2.335,0.75; 23 2.335,1.25; 24 2.335,1.75 | smd 0.28 x 0.63: 9 -1.75,-2.335; 10 -1.25,-2.335; 11 -0.75,-2.335; 12 -0.25,-2.335; 13 0.25,-2.335; 14 0.75,-2.335; 15 1.25,-2.335; 16 1.75,-2.335; 25 1.75,2.335; 26 1.25,2.335; 27 0.75,2.335; 28 0.25,2.335; 29 -0.25,2.335; 30 -0.75,2.335; 31 -1.25,2.335; 32 -1.75,2.335 | smd 3.2 x 3.2: EP 0,0
RESONATOR-SMD-3.2X1.3 = smd 0.45 x 1.905: 1 -1.2,0; 2 0,0; 3 1.2,0

### Placement (x,y rotation side)
5V  52.07,7.75 180 top
C1  20.93,1.4 180 top
C2  35.94,2.41 270 top
C3  37.59,5.46 0 top
C5  37.59,7.49 0 top
C7  49.05,6.17 0 top
C8  45.72,2.41 90 top
C9  24.03,1.4 0 top
C10  49.1,10.92 0 top
GND  52.07,5.84 180 top
Q1  43.18,7.62 90 top
Q2  43.18,10.79 90 top
R1  40.77,10.79 270 top
R2  45.72,10.79 270 top
R3  16.89,11.18 90 top
R4  14.86,9.5 270 top
R5  37.97,2.41 90 top
R6  25.02,11.18 270 top
R7  40.01,2.41 270 top
R8  18.92,11.18 90 top
R9  12.83,9.53 270 top
R10  12.83,6.48 90 top
R11  45.72,7.62 90 top
R12  14.86,6.48 90 top
R13  22.99,11.18 90 top
R14  29.72,10.54 0 top
R15  40.77,7.72 270 top
R16  17.78,3.81 180 top
R17  17.78,1.4 0 top
R19  12.83,3.05 270 top
R20  14.86,3.05 270 top
SCL3.3V  52.07,11.56 180 top
SDA3.3V  52.07,9.65 180 top
TEMP1  2.92,9.65 0 top
TEMP1-5V  6.99,7.49 0 top
TEMP2  5.46,9.65 180 top
TEMP2-5V  8,2.92 0 top
TEMP3  8,9.65 0 top
TEMP3-5V  2.92,2.92 0 top
TEMP4  10.54,9.65 0 top
TEMP4-5V  1.9,7.49 0 top
TEMP5  9.53,5.08 0 top
TEMP5-5V  5.46,2.92 0 top
TEMP6  6.99,5.08 0 top
TEMP6-5V  4.45,7.49 0 top
TEMP7  4.45,5.08 0 top
TEMP7-5V  9.53,7.49 0 top
TEMP8  1.9,5.08 0 top
TEMP8-5V  10.54,2.92 0 top
TP1  36.58,5.97 180 bottom
TP2  36.58,8.51 270 bottom
TP3  34.04,5.97 180 bottom
TP4  34.04,8.51 180 bottom
TP5  31.48,5.97 180 bottom
TP6  31.5,8.51 180 bottom
U1  23.57,5.47 270 top
U2  49.02,8.51 270 top
U5  42.8,2.79 0 top
U6  32.64,6.73 0 top
Y1  30.35,2.54 180 top

### Tracks (layer width: path | path; a pad name or v marks a point on that pad's centre or on a via)
3.3V
  Top 0.254: R2.2 45.52,10.14 Q2.1 43.43,9.47 43.43,7.64 Q1.1
  Top 0.305: R2.2 46.39,9.95 47.39,10.94 47.39,11.55 47.57,11.73 49.81,11.73 49.97,11.57 49.97,10.9 | U2.5 49.97,10.9 | 49.97,10.9 C10.2
  Top 0.406: 45.54,8.47 R11.2 R2.2 45.62,9.85
+5V  (via drill 0.35)
  Top 0.254: v37.59,6.48 37.02,6.48 36.74,6.2 C3.1 34.99,5.46 U6.18 | U6.6 29.55,5.98 29.44,6.1 v29.44,6.48 29.44,6.86 29.56,6.98 U6.4 | v27.69,10.92 28.07,10.54 R14.1
  Top 0.305: R1.2 39.37,9.95 | 39.37,9.95 37.12,9.95 v36.96,9.78 | R15.2 39.99,6.87 39.37,7.49 39.37,9.95 | C9.1 C1.1 21.78,2.22 21.72,2.29 | U1.28 24.82,2.54 24.57,2.29 21.72,2.29 | R16.1 19.47,2.97 v19.47,2.54 19.72,2.29 21.72,2.29 | C7.2 49.97,6.25 U2.4 51.96,7.86 5V.1 | U5.3 U5.4 44.13,4.14 44.43,4.45 v44.82,4.45
  Top 0.406: C8.2 45.72,4.03 45.3,4.45 v44.82,4.45
  Bottom 0.254: TP2.P$1 37.59,8.51
  Bottom 0.406: TEMP7-5V.1 TEMP1-5V.1 TEMP6-5V.1 TEMP4-5V.1 0.58,6.17 0.58,4.32 1.98,2.92 TEMP3-5V.1 TEMP5-5V.1 TEMP2-5V.1 TEMP8-5V.1 12.88,0.58 19.69,0.58 | 30.61,10.53 28.08,10.53 v27.69,10.92 | 30.61,10.53 32.94,10.53 33.69,9.78 v36.96,9.78 37.59,9.14 37.59,8.51 v37.59,6.48 42.79,6.48 v44.82,4.45 46.99,4.45 50.29,7.75 5V.1 53.23,6.59 53.23,1.79 52.02,0.58 19.69,0.58 | v29.44,6.48 29.97,6.48 30.61,7.11 30.61,10.53 | v19.47,2.54 19.47,0.8 19.69,0.58
AREF
  Top 0.254: C5.1 36.74,6.77 36.45,6.48 U6.20
CH0
  Top 0.254: U1.8 22.82,8.93 21.4,10.36 18.95,10.36 R8.1 18.05,11.2 16.17,11.2 15.08,12.29 5.56,12.29 TEMP1.1
CH1
  Top 0.254: U1.9 22.32,8.85 21.73,9.44 16.98,9.44 16.89,9.53 R3.1 16.34,10.33 14.78,11.89 7.7,11.89 TEMP2.1
CH2
  Top 0.254: U1.10 21.82,8.78 21.57,9.03 16.74,9.03 15.42,10.35 R4.1 14.86,11.11 14.49,11.48 9.83,11.48 TEMP3.1
CH3
  Top 0.254: U1.11 21.32,8.52 21.21,8.63 16.57,8.63 15.71,9.49 14.22,9.49 13.33,10.38 R9.1 | 12.83,10.3 R9.1 | R9.1 12.79,10.41 11.3,10.41 TEMP4.1
CH4
  Top 0.254: R10.1 13.68,6.48 15.87,6.48 17.32,7.93 U1.12
  Top 0.305: TEMP5.1 10.03,5.59 12.79,5.59 R10.1
CH5
  Top 0.254: U1.13 17.13,6.97 15.79,5.63 R12.1 14.27,5.63 13.44,4.8 10.77,4.8 9.97,4 9.08,4 8,5.08 TEMP6.1
CH6
  Top 0.254: R19.1 13.41,3.9 14.24,4.73 15.67,4.73 17.42,6.47 U1.14 | TEMP7.1 5.27,4.25 6.04,4.25 6.79,3.5 6.79,2.6 7.55,1.84 10.99,1.84 11.62,2.47 11.62,3.62 11.9,3.9 R19.1 | R19.1 12.83,3.68 | 12.53,3.9 R19.1
CH7
  Top 0.254: R20.1 15.55,3.9 17.62,5.97 U1.15 | R20.1 14.86,3.85 | TEMP8.1 2.67,5.08 4.25,3.49 4.25,2.6 5.42,1.44 11.16,1.44 12.03,2.31 12.03,2.84 12.23,3.05 13.5,3.05 14.35,3.9 R20.1
COM  (via drill 0.25, 0.35)
  Top 0.203: U1.1 26.32,7.14 25.53,6.35 | 25.61,6.35 25.65,6.35 | U1.35 U1.32
  Top 0.254: U1.5 24.32,6.16 24.77,5.71 25.4,6.35 25.53,6.35 25.65,6.35 | U6.5 32.39,6.48 U6.EP | U6.21 32.89,6.98 U6.EP | U6.3 31.89,7.48 U6.EP
  Top 0.305: v28.7,5.56 28.19,5.56 27.83,5.19 | 27.83,5.19 27.81,5.18 | 27.83,5.19 27.83,3.31 27.56,3.05 27.18,3.05 26.87,2.74 v26.87,2.13
  Top 0.406: 48.51,5.08 48.26,5.33 48.26,6.13
  other vias: 48.26,2.54 17.86,2.57 10.79,6.35 1.9,10.79 34.04,10.54 25.98,1.24 20.95,12.06 39.75,5.46
  pour Top: 0.32,10.7 0.32,2.32 2.32,0.32 27.37,0.32 27.37,12.7 2.32,12.7
  pour Bottom: 27.3,0.38 27.3,12.57 2.38,12.57 0.38,10.57 0.38,2.38 2.38,0.38
  pour Bottom: 28.19,12.7 28.19,0.38 52.2,0.38 53.47,1.65 53.47,12.06 52.83,12.7
  pour Top: 28.45,12.7 28.45,0.38 52.2,0.38 53.47,1.65 53.47,12.06 52.83,12.7
IO2
  Top 0.203: U6.32 28.55,9.07 27.73,8.25 27.73,8.04 27.02,7.33 U1.38
IO3
  Top 0.203: U6.1 30.06,8.48 29.84,8.7 28.68,8.7 28.09,8.11 28.09,7.87 27.69,7.46 27.69,6.61 27.56,6.48 U1.37
IO4
  Top 0.203: U6.2 30.2,8.09 29.8,8.09 29.55,8.33 28.83,8.33 28.45,7.95 28.45,7.72 28.04,7.32 28.04,6.07 27.95,5.97 U1.36
MISO/IO12  (via drill 0.35)
  Top 0.254: v34.54,3.43 34.39,3.58 U6.16
  Bottom 0.203: v34.54,3.43 35.13,4.02 36.04,4.02 36.58,4.55 TP1.P$1
MOSI/IO11  (via drill 0.35)
  Top 0.254: v33.66,3.43 33.89,3.66 U6.15
  Bottom 0.203: v33.66,3.43 33.66,5.45 33.4,5.71 33.4,7.87 TP4.P$1
N$1
  Top 0.203: U6.7 30.28,5.5 29.88,5.5 29.15,4.77 Y1.3
N$2
  Top 0.254: U1.26 U1.27
N$3
  Top 0.254: U1.24 U1.25
N$4
  Top 0.305: U5.1 41.85,1.56 R7.2 R5.1
N$5
  Top 0.254: U1.7 23.32,9.1 22.99,9.44 R13.1 R6.2
N$7
  Top 0.203: U6.8 30.3,4.17 30.64,3.83 31.35,3.83 31.55,3.63 Y1.1
REF_V  (via drill 0.3, 0.35)
  Top 0.305: U1.29 25.32,2.41 25.55,2.19 25.9,2.19 27.45,0.64 27.81,0.64 | 27.81,0.64 33.4,0.64 34.33,1.56 C2.2 36.74,1.56 36.96,1.78 36.96,2.92 37.3,3.26 R5.2 37.97,3.94 38.18,4.14 U5.5 | v26.42,12.19 25.19,12.19 R6.1 | v27.73,1.91 27.81,1.82 27.81,0.64
  Bottom 0.305: v27.73,1.91 27.73,8.62 26.95,9.4 26.95,11.66 v26.42,12.19
RESET  (via drill 0.35)
  Top 0.254: R14.2 31.88,10.54 32.13,10.29 | U6.29 32.39,10.03 32.13,10.29 | v31.75,9.87 31.75,9.91 32.13,10.29
  Bottom 0.203: v31.75,9.87 31.93,9.87 32.26,9.53 32.26,6.74 TP5.P$1
SCK  (via drill 0.35)
  Top 0.203: U6.17 35.47,4.98 35.81,4.64 v35.81,4.57
  Bottom 0.203: TP3.P$1 34.04,5.33 34.8,4.57 v35.81,4.57
SCL3.3V
  Top 0.254: SCL3.3V.1 51.47,12.16 47.39,12.16 46.88,11.64 R2.1 44.96,11.64 44.76,11.45 Q2.2
SCL5V
  Top 0.203: Q2.3 42.13,10.91 | U6.28 32.89,11.96 32.89,11.97
  Top 0.254: U1.2 25.82,8.43 27.04,9.65 27.04,11.3 27.7,11.97 32.89,11.97 37.72,11.97 38.23,11.46 40.58,11.46 R1.1 41.91,11.64 42.26,11.3 Q2.3
SDA3.3V
  Top 0.254: Q1.2 44.83,7.54 44.83,7.11 45.17,6.77 R11.1 45.72,5.75 47.09,4.38 52.14,4.38 53.34,5.58 53.34,8.38 SDA3.3V.1
SDA5V
  Top 0.203: U6.27 33.39,10.78 33.91,11.3 34.8,11.3 35.31,10.79 41.53,10.79 41.65,10.67 41.65,10.34 41.83,10.16 42.93,10.16
  Top 0.254: U1.3 25.32,8.56 26.54,9.78 26.54,11.37 27.64,12.47 41.67,12.47 42.93,11.22 42.93,10.16 42.93,9.65 42.26,8.98 42.26,8.64 | 42.26,8.64 Q1.3 | R15.1 42.19,8.57 42.26,8.64
VCC_READ
  Top 0.254: U1.16 17.7,5.47 16.93,4.71 R16.2 R17.1

### Text on the board
tDocu: Thermal Stake-8 / v0.1 / Evan Grove / Bobby Schulz
bDocu: SCL | 0 | 1 | 2 | 3 | SDA | GND | MOSI | VCC | Vin | RESET | SCK | MISO | GND | 4 | 5 | 6 | 7